# EAGLE design TraceurDessinateur_Camera (EAGLE 9.6.2)
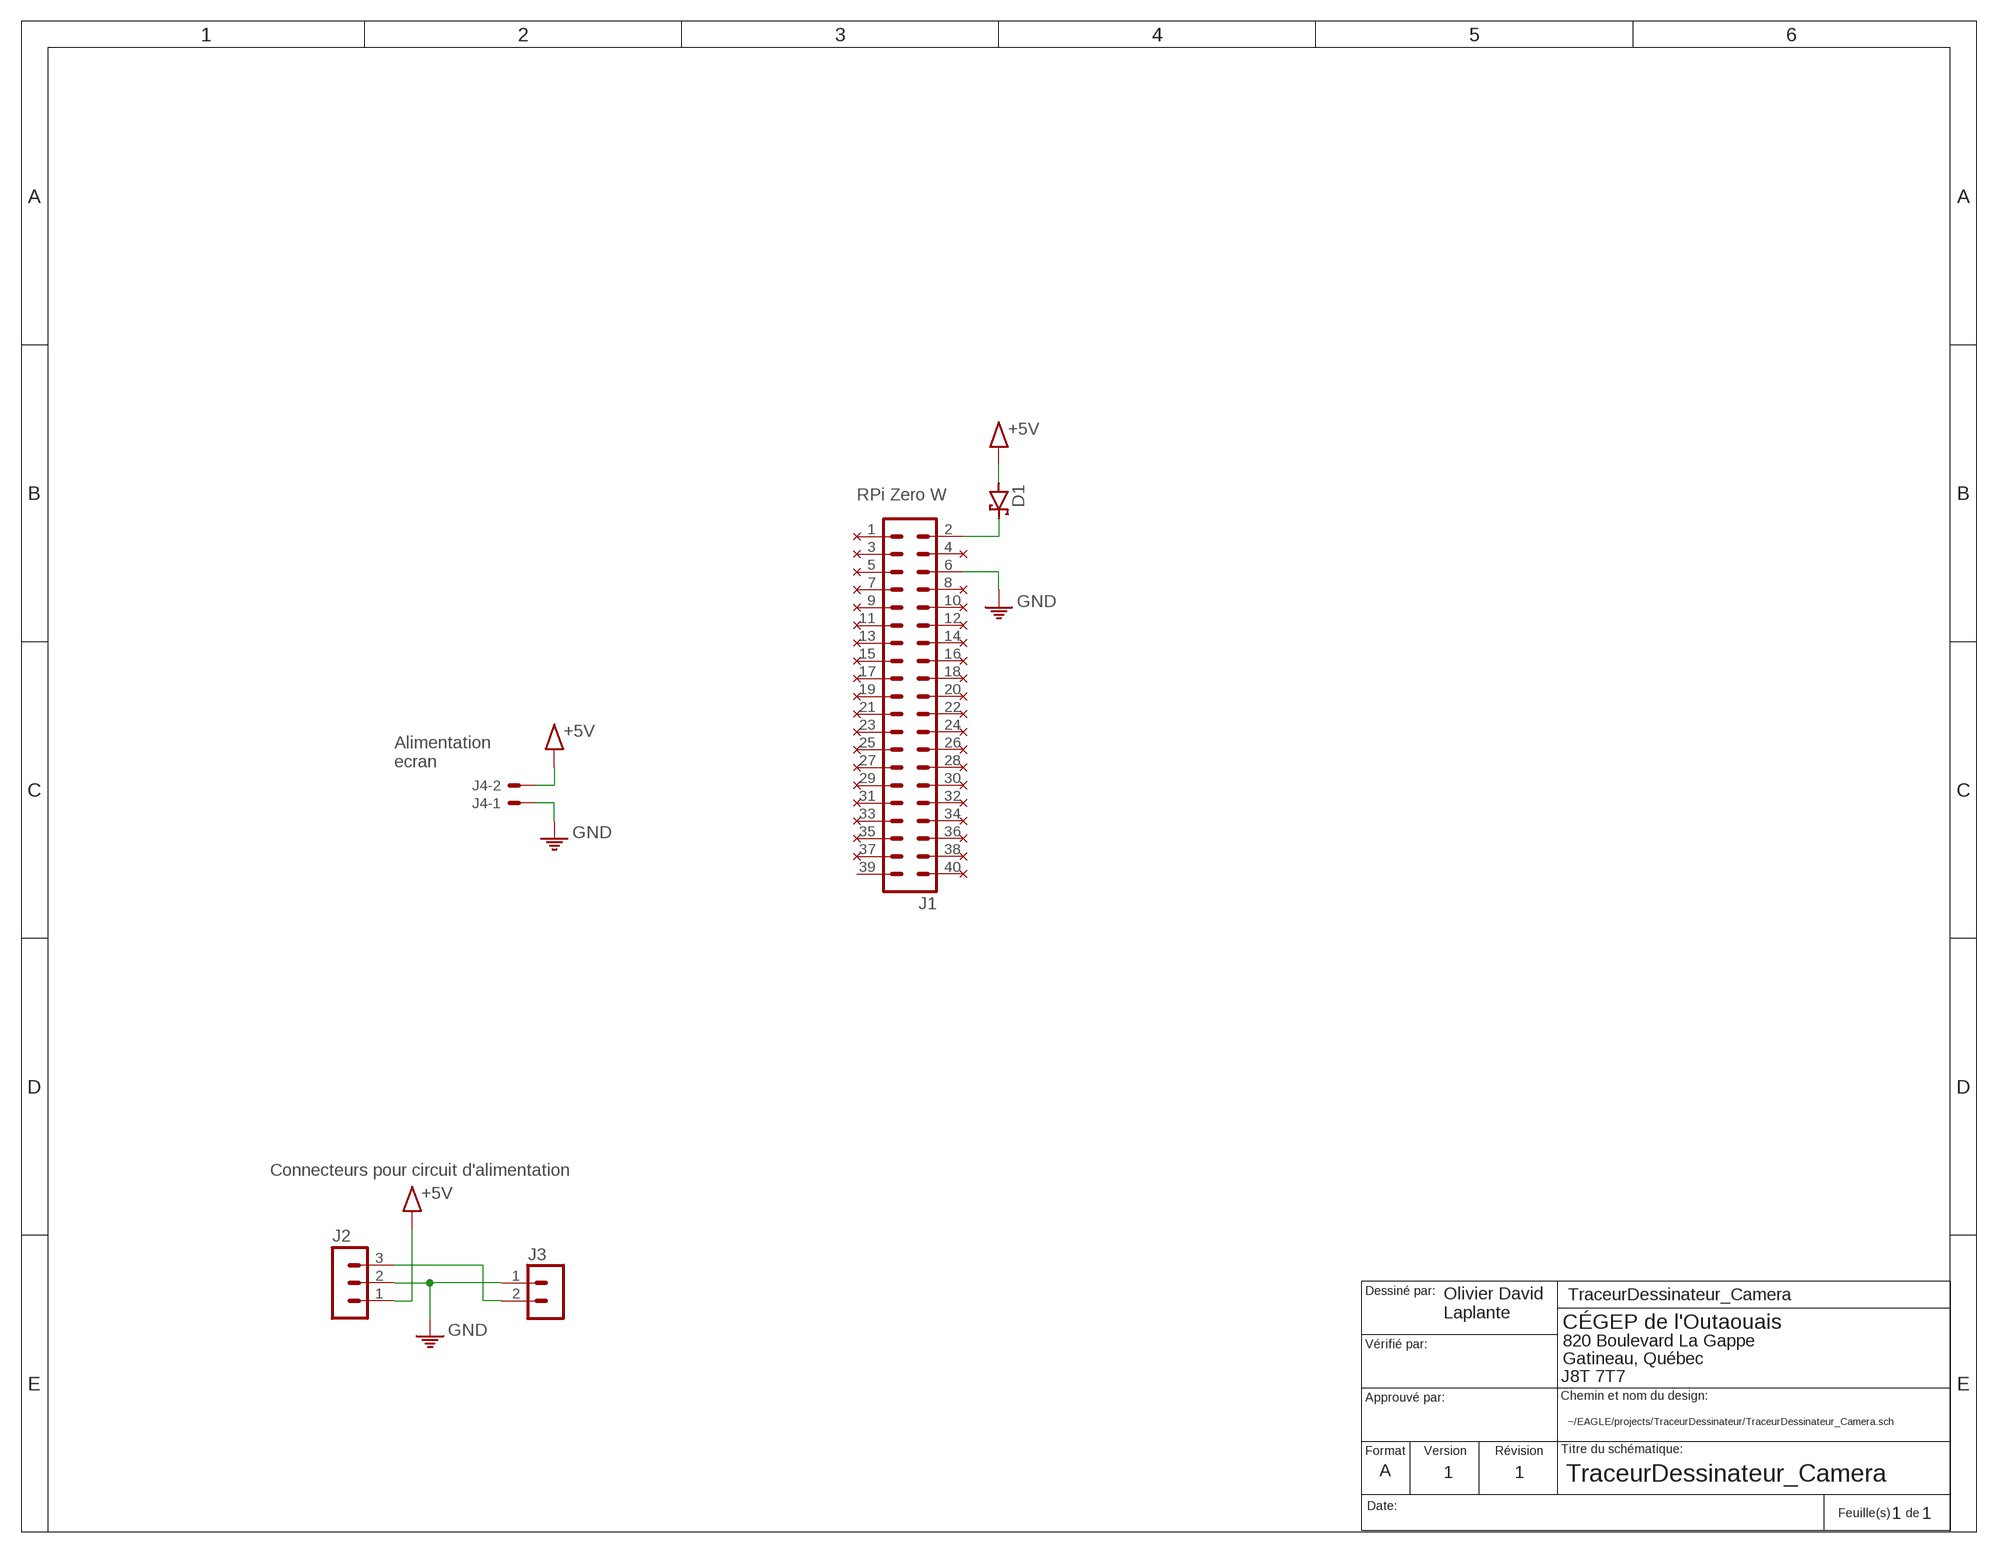
[diagram p0: schematic, sheet 1]

## Parts
D1  1N5817-B  [DO41-7.6]
J1  MA20-2  [MA20-2]
J2  MA03-1  [MA03-1]
J3  B2B-PH-K  [B2B-PH-K]
J4  22-23-2021  [22-23-2021]
U$1  NC  (no package)
U$2  NC  (no package)
U$3  NC  (no package)
U$4  NC  (no package)
U$5  NC  (no package)
U$6  NC  (no package)
U$7  NC  (no package)
U$8  NC  (no package)
U$9  NC  (no package)
U$10  NC  (no package)
U$11  NC  (no package)
U$12  NC  (no package)
U$13  NC  (no package)
U$14  NC  (no package)
U$15  NC  (no package)
U$16  NC  (no package)
U$17  NC  (no package)
U$18  NC  (no package)
U$19  NC  (no package)
U$20  NC  (no package)
U$21  NC  (no package)
U$22  NC  (no package)
U$23  NC  (no package)
U$24  NC  (no package)
U$25  NC  (no package)
U$26  NC  (no package)
U$27  NC  (no package)
U$28  NC  (no package)
U$29  NC  (no package)
U$30  NC  (no package)
U$31  NC  (no package)
U$32  NC  (no package)
U$33  NC  (no package)
U$34  NC  (no package)
U$35  NC  (no package)
U$36  NC  (no package)
U$38  NC  (no package)

## Nets
+5V: D1.A J2.1 J4.2
GND: J1.6 J2.2 J3.1 J4.1
N$1: J1.1 U$1.P$1
N$2: J1.3 U$2.P$1
N$3: J1.5 U$3.P$1
N$4: J1.7 U$4.P$1
N$5: J1.9 U$5.P$1
N$6: J1.11 U$6.P$1
N$7: J1.13 U$7.P$1
N$8: J1.15 U$8.P$1
N$9: J1.17 U$9.P$1
N$10: J1.19 U$10.P$1
N$11: J1.21 U$11.P$1
N$12: J1.23 U$12.P$1
N$13: J1.25 U$13.P$1
N$14: J1.27 U$14.P$1
N$15: J1.29 U$15.P$1
N$16: J1.31 U$16.P$1
N$17: J1.33 U$17.P$1
N$18: J1.35 U$18.P$1
N$19: J1.37 U$19.P$1
N$20: J1.40 U$20.P$1
N$21: J1.38 U$21.P$1
N$22: J1.36 U$22.P$1
N$23: J1.34 U$23.P$1
N$24: J1.32 U$24.P$1
N$25: J1.30 U$25.P$1
N$26: J1.28 U$26.P$1
N$27: J1.26 U$27.P$1
N$28: J1.24 U$28.P$1
N$29: J1.22 U$29.P$1
N$30: J1.20 U$30.P$1
N$31: J1.18 U$31.P$1
N$32: J1.16 U$32.P$1
N$33: J1.14 U$33.P$1
N$34: J1.12 U$34.P$1
N$35: J1.10 U$35.P$1
N$36: J1.8 U$36.P$1
N$37: D1.C J1.2
N$38: J1.4 U$38.P$1
VBAT: J2.3 J3.2
Unconnected: J1.39

## Notes on the sheet
- RPi Zero W
- Alimentation
  ecran
- Connecteurs pour circuit d'alimentation
- TraceurDessinateur_Camera
- Olivier David
  Laplante
- ~/EAGLE/projects/TraceurDessinateur/TraceurDessinateur_Camera.sch
- A | 1 | 1
- 1 | 1

## Library data of the parts
D1 = diode:1N581*: 1.0A SCHOTTKY BARRIER RECTIFIER Source: http://www.diodes.com/datasheets/ds23001.pdf
J1 = con-lstb:MA20-2: PIN HEADER; OC_FARNELL: unknown; OC_NEWARK: unknown
J2 = con-lstb:MA03-1: PIN HEADER; OC_FARNELL: unknown; OC_NEWARK: unknown
J3 = con-jst-ph:B2B-PH-K: HEADER
J4 = con-molex:22-23-2021: .100" (2.54mm) Center Header - 2 Pin; MF: MOLEX; MPN: 22-23-2021; OC_FARNELL: 1462926; OC_NEWARK: 25C3832
U$1-U$36 U$38 = 1_Personnal:NC

## Board
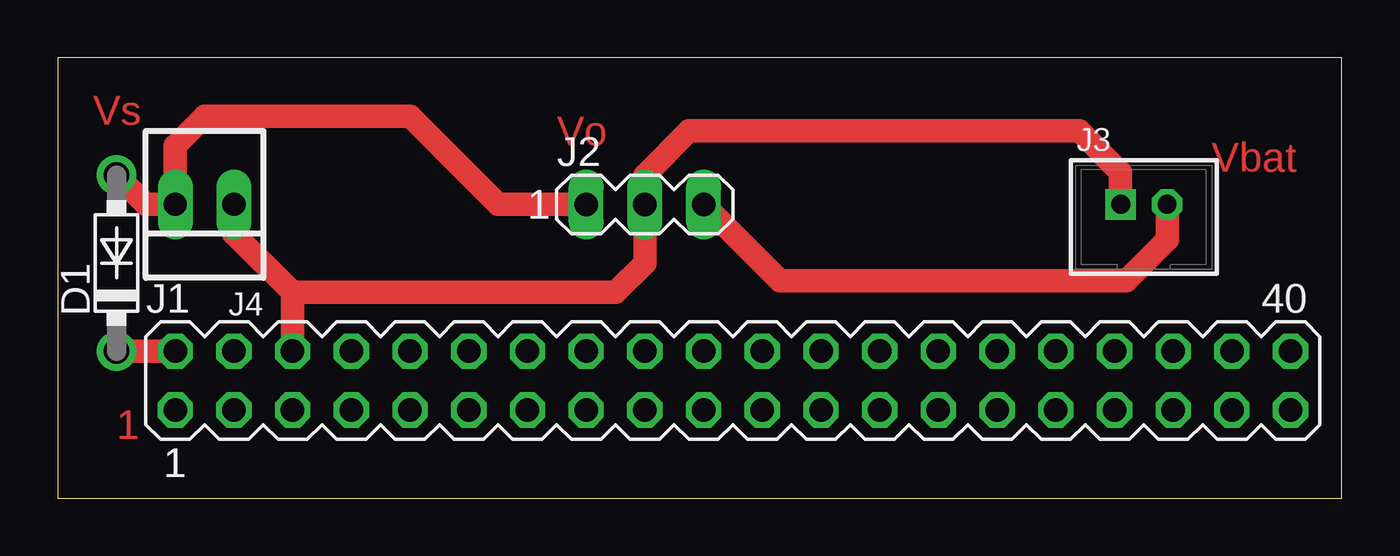
[diagram p1: board, top side]

Size 55.55 x 19.04 mm. Coordinates in mm from the lower left corner, seen from the top.
Outline: 0,0 55.55,0 55.55,19.04 0,19.04 0,0
Copper layers (1*16): Top 0.035mm / dielectric 1.5mm / Bottom 0.035mm
Design rules "default *": minimum track width 6mil, minimum drill 0.35mm, track to track 6mil, track to pad 6mil, pad to pad 6mil, via to via 6mil, smd to smd 6mil, copper to edge 20mil, drill to drill 6mil, minimum pad ring 10mil, minimum via ring 8mil, stop-mask expansion 4mil, vias tented up to drill 0mil, thermal gap 10mil

### Footprints (pad centres in the part's own frame; a part is rotated, then mirrored left to right if it is on the bottom)
DO41-7.6 = drill 1.1 pad 1.7: A 3.81,0; C -3.81,0
MA20-2 = drill 1.016 octagon: 1 -24.13,-1.27; 2 -24.13,1.27; 3 -21.59,-1.27; 4 -21.59,1.27; 5 -19.05,-1.27; 6 -19.05,1.27; 7 -16.51,-1.27; 8 -16.51,1.27; 9 -13.97,-1.27; 10 -13.97,1.27; 11 -11.43,-1.27; 12 -11.43,1.27; 13 -8.89,-1.27; 14 -8.89,1.27; 15 -6.35,-1.27; 16 -6.35,1.27; 17 -3.81,-1.27; 18 -3.81,1.27; 19 -1.27,-1.27; 20 -1.27,1.27; 21 1.27,-1.27; 22 1.27,1.27; 23 3.81,-1.27; 24 3.81,1.27; 25 6.35,-1.27; 26 6.35,1.27; 27 8.89,-1.27; 28 8.89,1.27; 29 11.43,-1.27; 30 11.43,1.27; 31 13.97,-1.27; 32 13.97,1.27; 33 16.51,-1.27; 34 16.51,1.27; 35 19.05,-1.27; 36 19.05,1.27; 37 21.59,-1.27; 38 21.59,1.27; 39 24.13,-1.27; 40 24.13,1.27
MA03-1 = drill 1.016 long: 1 -2.54,0; 2 0,0; 3 2.54,0
B2B-PH-K = drill 0.813 square: 1 -1,0 | drill 0.813 octagon: 2 1,0
22-23-2021 = drill 1 long: 1 -1.27,0; 2 1.27,0

### Placement (x,y rotation side)
D1  2.54,10.16 90 top
J1  29.21,5.08 0 top
J2  25.4,12.7 0 top
J3  46.99,12.7 0 top
J4  6.35,12.7 180 top
U$37  [A3L-LOC]  -50.8,-29.21 0 top  (outside the outline)

### Tracks (layer width: path | path; a pad name or v marks a point on that pad's centre or on a via)
+5V
  Top 1.016: J2.1 19.05,12.7 15.24,16.51 6.35,16.51 5.08,15.24 J4.2 3.81,12.7 D1.A
GND
  Top 1.016: J1.6 10.16,8.89 | 10.16,8.89 7.62,11.43 J4.1 | 10.16,8.89 24.13,8.89 25.4,10.16 J2.2 25.4,13.97 27.31,15.88 44.2,15.88 45.97,14.1 45.97,12.72 J3.1
N$37
  Top 1.016: J1.2 D1.C
VBAT
  Top 1.016: J2.3 31.24,9.4 46.23,9.4 48.01,11.18 48.01,12.68 J3.2

### Text on the board
Top: Vs | Vo | Vbat | 1
Document: Dessine par: / Olivier David Laplante | CEGEP de l'Outaouais / 820 Boulevard La Gappe / Gatineau, Quebec / J8T 7T7 | Format: A4 | Rev: 1.0 | 1 de 1